# Altium schematic sheet Serializer_SystemR2.SchDoc: Parent Sheet Block Diagram
size A; Revision: 1; SheetNumber: 1; SheetTotal: 5; RevisionHistory: Updated from v3.2 Miniscope.org
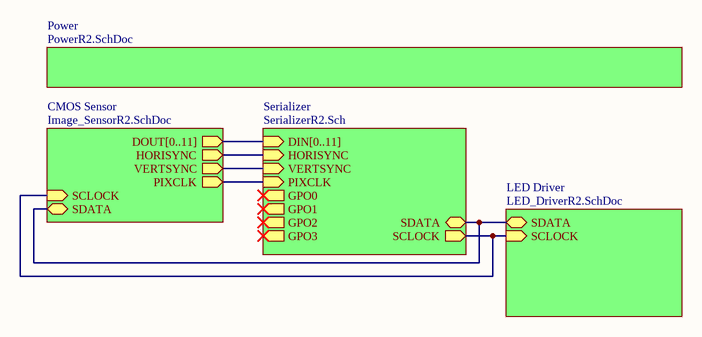
[diagram p0: Serializer_SystemR2.SchDoc]

## Sub-sheets
CMOS Sensor = Image_SensorR2.SchDoc: HORISYNC (out), VERTSYNC (out), PIXCLK (out), SCLOCK (in), SDATA (bidir), DOUT[0..11] (out)
LED Driver = LED_DriverR2.SchDoc: SCLOCK (in), SDATA (bidir)
Power = PowerR2.SchDoc: no entries
Serializer = SerializerR2.Sch: HORISYNC (in), VERTSYNC (in), PIXCLK (in), SDATA (bidir), SCLOCK (out), GPO0 (out), GPO1 (out), GPO2 (out), GPO3 (out), DIN[0..11] (in)

## Nets
(unnamed): sheet Serializer/HORISYNC, sheet CMOS Sensor/HORISYNC
(unnamed): sheet Serializer/VERTSYNC, sheet CMOS Sensor/VERTSYNC
(unnamed): sheet Serializer/PIXCLK, sheet CMOS Sensor/PIXCLK
(unnamed): sheet Serializer/SDATA, sheet LED Driver/SDATA, sheet CMOS Sensor/SDATA
(unnamed): sheet Serializer/SCLOCK, sheet LED Driver/SCLOCK, sheet CMOS Sensor/SCLOCK

## Buses and harness runs
bus sheet CMOS Sensor/DOUT[0..11] = sheet Serializer/DIN[0..11]

## Notes on the sheet
- Title
- Rice University
- Kemere Lab
- Date:
- Size:
- File:
- Revision History
- B
- Revision:
- Sheet
- of
- Project Name
- 6100 Main St.
- Houston, TX